# EAGLE design PDB (EAGLE 9.1.3)
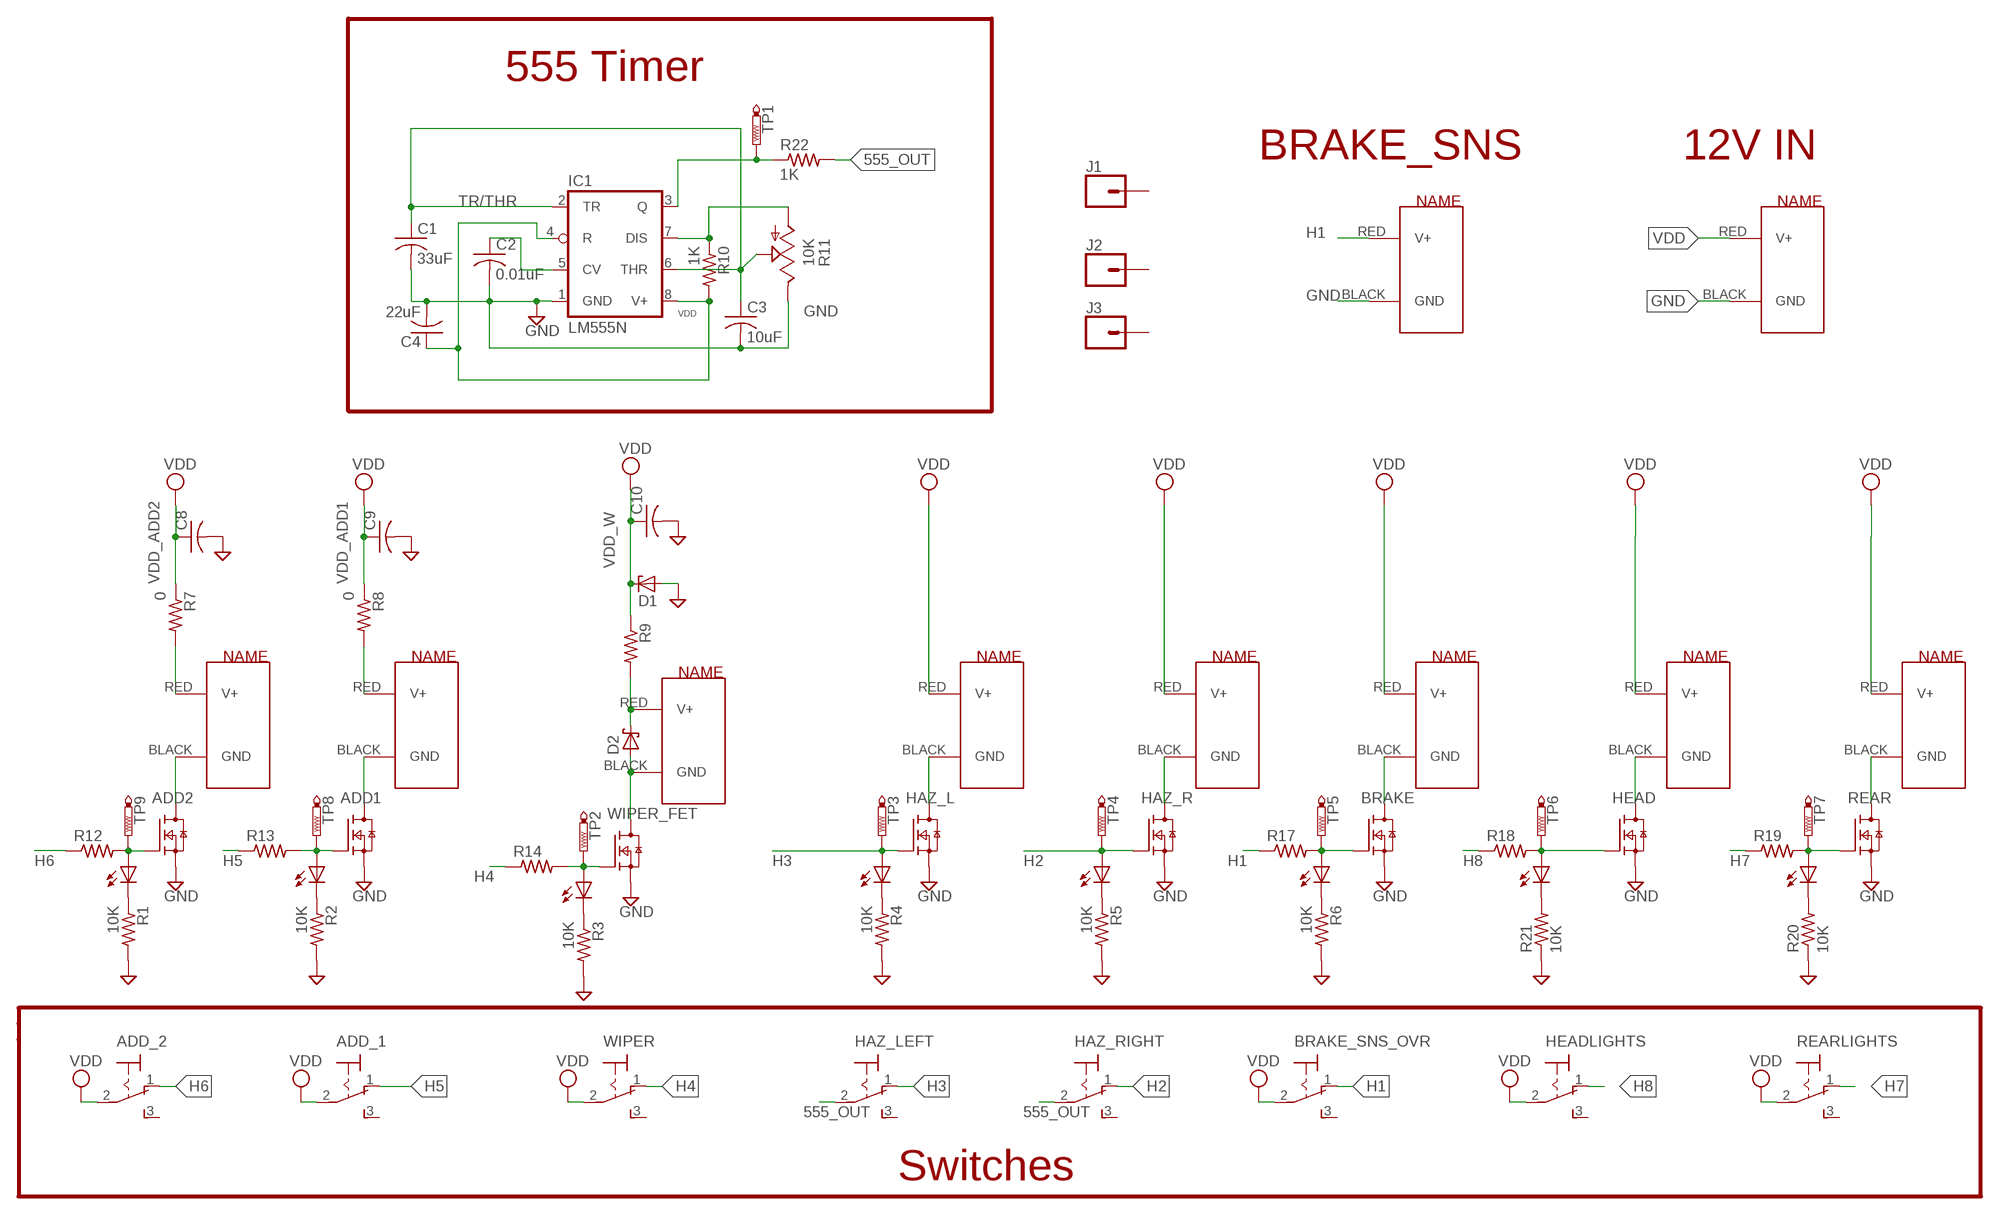
[diagram p0: schematic, sheet 1]

## Parts
ADD1  PSMN039-100YS  [SOT669]
ADD1_OUT  POWERPOLE_POWER25A_HORIZONTAL_G2  [POWERPOLE_PAIR_25A_HORIZ_G2]
ADD2  PSMN039-100YS  [SOT669]
ADD2_OUT  POWERPOLE_POWER25A_HORIZONTAL_G2  [POWERPOLE_PAIR_25A_HORIZ_G2]
ADD_1  M9040P  [M9040P]
ADD_2  M9040P  [M9040P]
BRAKE  PSMN039-100YS  [SOT669]
BRAKE_OUT  POWERPOLE_POWER25A_HORIZONTAL_G2  [POWERPOLE_PAIR_25A_HORIZ_G2]
BRAKE_SNS_OVR  M9040P  [M9040P]
C1  33uF  C-USC0805  [C0805]
C2  0.01uF  C-USC0805  [C0805]
C3  10uF  C-USC0805K  [C0805K]
C4  22uF  C-USC0805  [C0805]
C8  C-USC0805  [C0805]
C9  C-USC0805  [C0805]
C10  C-USC0805  [C0805]
D1  ZENER-DIODEDO34-7  [DO34Z7]
D2  1N5817-B  [DO41-7.6]
HAZ_L  PSMN039-100YS  [SOT669]
HAZ_LEFT  M9040P  [M9040P]
HAZ_R  PSMN039-100YS  [SOT669]
HAZ_RIGHT  M9040P  [M9040P]
HAZL_OUT  POWERPOLE_POWER25A_HORIZONTAL_G2  [POWERPOLE_PAIR_25A_HORIZ_G2]
HAZR_OUT  POWERPOLE_POWER25A_HORIZONTAL_G2  [POWERPOLE_PAIR_25A_HORIZ_G2]
HEAD  PSMN039-100YS  [SOT669]
HEADLIGHTS  M9040P  [M9040P]
HEADLIGHTS_OUT  POWERPOLE_POWER25A_HORIZONTAL_G2  [POWERPOLE_PAIR_25A_HORIZ_G2]
IC1  LM555N  [DIL08]
J1  CONN_01  [1X01]
J2  CONN_01  [1X01]
J3  CONN_01  [1X01]
LED1  LEDCHIP-LED0805  [CHIP-LED0805]
LED2  LEDCHIP-LED0805  [CHIP-LED0805]
LED3  LEDCHIP-LED0805  [CHIP-LED0805]
LED4  LEDCHIP-LED0805  [CHIP-LED0805]
LED5  LEDCHIP-LED0805  [CHIP-LED0805]
LED6  LEDCHIP-LED0805  [CHIP-LED0805]
LED7  LEDCHIP-LED0805  [CHIP-LED0805]
LED8  LEDCHIP-LED0805  [CHIP-LED0805]
R1  10K  R-US_R0805  [R0805]
R2  10K  R-US_R0805  [R0805]
R3  10K  R-US_R0805  [R0805]
R4  10K  R-US_R0805  [R0805]
R5  10K  R-US_R0805  [R0805]
R6  10K  R-US_R0805  [R0805]
R7  0  R-US_R0805  [R0805]
R8  0  R-US_R0805  [R0805]
R9  R-US_R0805  [R0805]
R10  1K  R-US_R0805  [R0805]
R11  10K  TRIM_US-B25U  [B25U]
R12  R-US_R0805  [R0805]
R13  R-US_R0805  [R0805]
R14  R-US_R0805  [R0805]
R17  R-US_R0805  [R0805]
R18  R-US_R0805  [R0805]
R19  R-US_R0805  [R0805]
R20  10K  R-US_R0805  [R0805]
R21  10K  R-US_R0805  [R0805]
R22  1K  R-US_R0805  [R0805]
REAR  PSMN039-100YS  [SOT669]
REARLIGHTS  M9040P  [M9040P]
REARLIGHTS_OUT  POWERPOLE_POWER25A_HORIZONTAL_G2  [POWERPOLE_PAIR_25A_HORIZ_G2]
TP1  PTR1B1,27  [B1,27]
TP2  PTR1B1,27  [B1,27]
TP3  PTR1B1,27  [B1,27]
TP4  PTR1B1,27  [B1,27]
TP5  PTR1B1,27  [B1,27]
TP6  PTR1B1,27  [B1,27]
TP7  PTR1B1,27  [B1,27]
TP8  PTR1B1,27  [B1,27]
TP9  PTR1B1,27  [B1,27]
VDD_IN  POWERPOLE_POWER25A_HORIZONTAL_G2  [POWERPOLE_PAIR_25A_HORIZ_G2]
VDD_IN1  POWERPOLE_POWER25A_HORIZONTAL_G2  [POWERPOLE_PAIR_25A_HORIZ_G2]
WIPER  M9040P  [M9040P]
WIPER_FET  PSMN039-100YS  [SOT669]
WIPER_OUT  POWERPOLE_POWER25A_HORIZONTAL_G2  [POWERPOLE_PAIR_25A_HORIZ_G2]

## Nets
555_OUT: HAZ_LEFT.2(P) HAZ_RIGHT.2(P) R22.2
CV: C2.1 IC1.5(CV)
DIS: IC1.7(DIS) R10.1 R11.A
GND: ADD1.1(S) ADD1.2(S) ADD1.3(S) ADD2.1(S) ADD2.2(S) ADD2.3(S) BRAKE.1(S) BRAKE.2(S) BRAKE.3(S) C1.2 C2.2 C3.2 C4.2 C8.2 C9.2 C10.2 D1.A HAZ_L.1(S) HAZ_L.2(S) HAZ_L.3(S) HAZ_R.1(S) HAZ_R.2(S) HAZ_R.3(S) HEAD.1(S) HEAD.2(S) HEAD.3(S) IC1.1(GND) R1.2 R2.2 R3.2 R4.2 R5.2 R6.2 R11.E R20.1 R21.1 REAR.1(S) REAR.2(S) REAR.3(S) VDD_IN1.BLACK(GND) VDD_IN.BLACK(GND) WIPER_FET.1(S) WIPER_FET.2(S) WIPER_FET.3(S)
H1: BRAKE_SNS_OVR.1(O) R17.1 VDD_IN1.RED(V+)
H2: HAZ_R.4(G) HAZ_RIGHT.1(O) LED5.A TP4.TP
H3: HAZ_L.4(G) HAZ_LEFT.1(O) LED4.A TP3.TP
H4: R14.1 WIPER.1(O)
H5: ADD_1.1(O) R13.1
H6: ADD_2.1(O) R12.1
H7: R19.1 REARLIGHTS.1(O)
H8: HEADLIGHTS.1(O) R18.1
N$1: HEAD.MB(D) HEADLIGHTS_OUT.BLACK(GND)
N$3: REAR.MB(D) REARLIGHTS_OUT.BLACK(GND)
N$7: ADD2.4(G) LED1.A R12.2 TP9.TP
N$8: ADD2.MB(D) ADD2_OUT.BLACK(GND)
N$9: LED8.C R20.2
N$10: LED7.C R21.2
N$11: LED5.C R5.1
N$13: BRAKE.4(G) LED6.A R17.2 TP5.TP
N$14: HEAD.4(G) LED7.A R18.2 TP6.TP
N$15: LED8.A R19.2 REAR.4(G) TP7.TP
N$16: ADD2_OUT.RED(V+) R7.2
N$17: ADD1.MB(D) ADD1_OUT.BLACK(GND)
N$18: ADD1_OUT.RED(V+) R8.2
N$19: D2.A WIPER_FET.MB(D) WIPER_OUT.BLACK(GND)
N$20: D2.C R9.2 WIPER_OUT.RED(V+)
N$21: HAZ_L.MB(D) HAZL_OUT.BLACK(GND)
N$22: LED3.A R14.2 TP2.TP WIPER_FET.4(G)
N$23: HAZ_R.MB(D) HAZR_OUT.BLACK(GND)
N$25: BRAKE.MB(D) BRAKE_OUT.BLACK(GND)
N$26: ADD1.4(G) LED2.A R13.2 TP8.TP
N$27: LED1.C R1.1
N$28: LED2.C R2.1
N$29: LED4.C R4.1
N$30: LED3.C R3.1
N$33: LED6.C R6.1
Q: IC1.3(Q) R22.1 TP1.TP
TR/THR: C1.1 C3.1 IC1.2(TR) IC1.6(THR) R11.S
VDD: ADD_1.2(P) ADD_2.2(P) BRAKE_OUT.RED(V+) BRAKE_SNS_OVR.2(P) C4.1 HAZL_OUT.RED(V+) HAZR_OUT.RED(V+) HEADLIGHTS.2(P) HEADLIGHTS_OUT.RED(V+) IC1.4(R) IC1.8(V+) R10.2 REARLIGHTS.2(P) REARLIGHTS_OUT.RED(V+) VDD_IN.RED(V+) WIPER.2(P)
VDD_ADD1: C9.1 R8.1 ; supply symbol labelled VDD
VDD_ADD2: C8.1 R7.1 ; supply symbol labelled VDD
VDD_W: C10.1 D1.C R9.1 ; supply symbol labelled VDD
Unconnected: ADD_1.3(S) ADD_2.3(S) BRAKE_SNS_OVR.3(S) HAZ_LEFT.3(S) HAZ_RIGHT.3(S) HEADLIGHTS.3(S) J1.1 J2.1 J3.1 REARLIGHTS.3(S) WIPER.3(S)

## Notes on the sheet
- 555 Timer
- BRAKE_SNS | 12V IN
- Switches

## Library data of the parts
ADD1 ADD2 BRAKE HAZ_L HAZ_R HEAD REAR WIPER_FET = nxp_60:PSMN: N-channel logic level TrenchMOS(TM) transistor AAL Eindhoven MK
ADD1_OUT ADD2_OUT BRAKE_OUT HAZL_OUT HAZR_OUT HEADLIGHTS_OUT REARLIGHTS_OUT VDD_IN VDD_IN1 WIPER_OUT = powerpoles:POWERPOLE_POWER: Anderson Powerpole Power Connector using ameteur radio standard layout
ADD_1 ADD_2 BRAKE_SNS_OVR HAZ_LEFT HAZ_RIGHT HEADLIGHTS REARLIGHTS WIPER = switch:M9040P: TOGGLE SWITCH Marquardt
C1-C4 C8-C10 = rcl:C-US: CAPACITOR, American symbol; SPICEPREFIX: C
D1 = diode:ZENER-DIODE: Z-Diode
D2 = diode:1N581*: 1.0A SCHOTTKY BARRIER RECTIFIER Source: http://www.diodes.com/datasheets/ds23001.pdf
IC1 = linear:*555: TIMER
J1-J3 = SparkFun-Connectors:CONN_01: Single connection point. Often used as Generic Header-pin footprint for 0.1 inch spaced/style header connections On any of the 0.1 inch spaced packages, you can populate with these: Break Away Headers - Straight <https://www.sparkfun.com/products/116> (PRT-00116) Break Away Male Headers - Right Angle <https://www.sparkfun.com/products/553> (PRT-00553) Female Headers <https://www.sparkfun.com/products/115> (PRT-00115) Break Away Headers - Machine Pin <https://www.sparkfun.com/products/117> (PRT-00117) Break Away Female Headers - Swiss Machine Pin <https://www.sparkfun.com/products/743> (PRT-00743) This device is also useful as a general connection point to wire up your design to another part of your project. Our various solder wires solder well into these plated through hole pads. Hook-Up Wire - Assortment (Stranded, 22 AWG) <https://www.sparkfun.com/products/11375> (PRT-11375) Hook-Up Wire - Assortment (Solid Core, 22 AWG) <https://www.sparkfun.com/products/11367> (PRT-11367) View the entire wire category on our website here <https://www.sparkfun.com/categories/141> Special notes: SMTSO-256-ET is a "flush mount" nut for a 4-40 screw. We mostly use this on specialty testbeds; it is a nice way to connect hardware to your PCB at an adjustable hieght. Also note, the SNAP packages are for using a snappable style connector. We sell a baggie of snaps and they are also used on two LilyPad designs: Snap Assortment - 30 pack (male and female) <https://www.sparkfun.com/products/11347> (DEV-11347) LilyPad Arduino SimpleSnap <https://www.sparkfun.com/products/10941> (DEV-10941) LilyPad SimpleSnap Protoboard <https://www.sparkfun.com/products/10940> (DEV-10940)
LED1-LED8 = led:LED: LED OSRAM: - CHIPLED LG R971, LG N971, LY N971, LG Q971, LY Q971, LO R971, LY R971 LH N974, LH R974 LS Q976, LO Q976, LY Q976 LO Q996 - Hyper CHIPLED LW Q18S LB Q993, LB Q99A, LB R99A - SideLED LS A670, LO A670, LY A670, LG A670, LP A670 LB A673, LV A673, LT A673, LW A673 LH A674 LY A675 LS A676, LA A676, LO A676, LY A676, LW A676 LS A679, LY A679, LG A679 - Hyper Micro SIDELED® LS Y876, LA Y876, LO Y876, LY Y876 LT Y87S - SmartLED LW L88C, LW L88S LB L89C, LB L89S, LG L890 LS L89K, LO L89K, LY L89K LS L896, LA L896, LO L896, LY L896 - TOPLED LS T670, LO T670, LY T670, LG T670, LP T670 LSG T670, LSP T670, LSY T670, LOP T670, LYG T670 LG T671, LOG T671, LSG T671 LB T673, LV T673, LT T673, LW T673 LH T674 LS T676, LA T676, LO T676, LY T676, LB T676, LH T676, LSB T676, LW T676 LB T67C, LV T67C, LT T67C, LS T67K, LO T67K, LY T67K, LW E67C LS E67B, LA E67B, LO E67B, LY E67B, LB E67C, LV E67C, LT E67C LW T67C LS T679, LY T679, LG T679 LS T770, LO T770, LY T770, LG T770, LP T770 LB T773, LV T773, LT T773, LW T773 LH T774 LS E675, LA E675, LY E675, LS T675 LS T776, LA T776, LO T776, LY T776, LB T776 LHGB T686 LT T68C, LB T68C - Hyper Mini TOPLED® LB M676 - Mini TOPLED Santana® LG M470 LS M47K, LO M47K, LY M47K Source: http://www.osram.convergy.de LUXEON: - LUMILED® LXK2-PW12-R00, LXK2-PW12-S00, LXK2-PW14-U00, LXK2-PW14-V00 LXK2-PM12-R00, LXK2-PM12-S00, LXK2-PM14-U00 LXK2-PE12-Q00, LXK2-PE12-R00, LXK2-PE12-S00, LXK2-PE14-T00, LXK2-PE14-U00 LXK2-PB12-K00, LXK2-PB12-L00, LXK2-PB12-M00, LXK2-PB14-N00, LXK2-PB14-P00, LXK2-PB14-Q00 LXK2-PR12-L00, LXK2-PR12-M00, LXK2-PR14-Q00, LXK2-PR14-R00 LXK2-PD12-Q00, LXK2-PD12-R00, LXK2-PD12-S00 LXK2-PH12-R00, LXK2-PH12-S00 LXK2-PL12-P00, LXK2-PL12-Q00, LXK2-PL12-R00 Source: www.luxeon.com KINGBRIGHT: KA-3528ASYC Source: www.kingbright.com
R1-R10 R12-R14 R17-R22 = rcl:R-US_: RESISTOR, American symbol; SPICEPREFIX: R
R11 = pot:TRIM_US-: POTENTIOMETER
TP1-TP9 = testpad:PTR1: TEST PIN

## Board
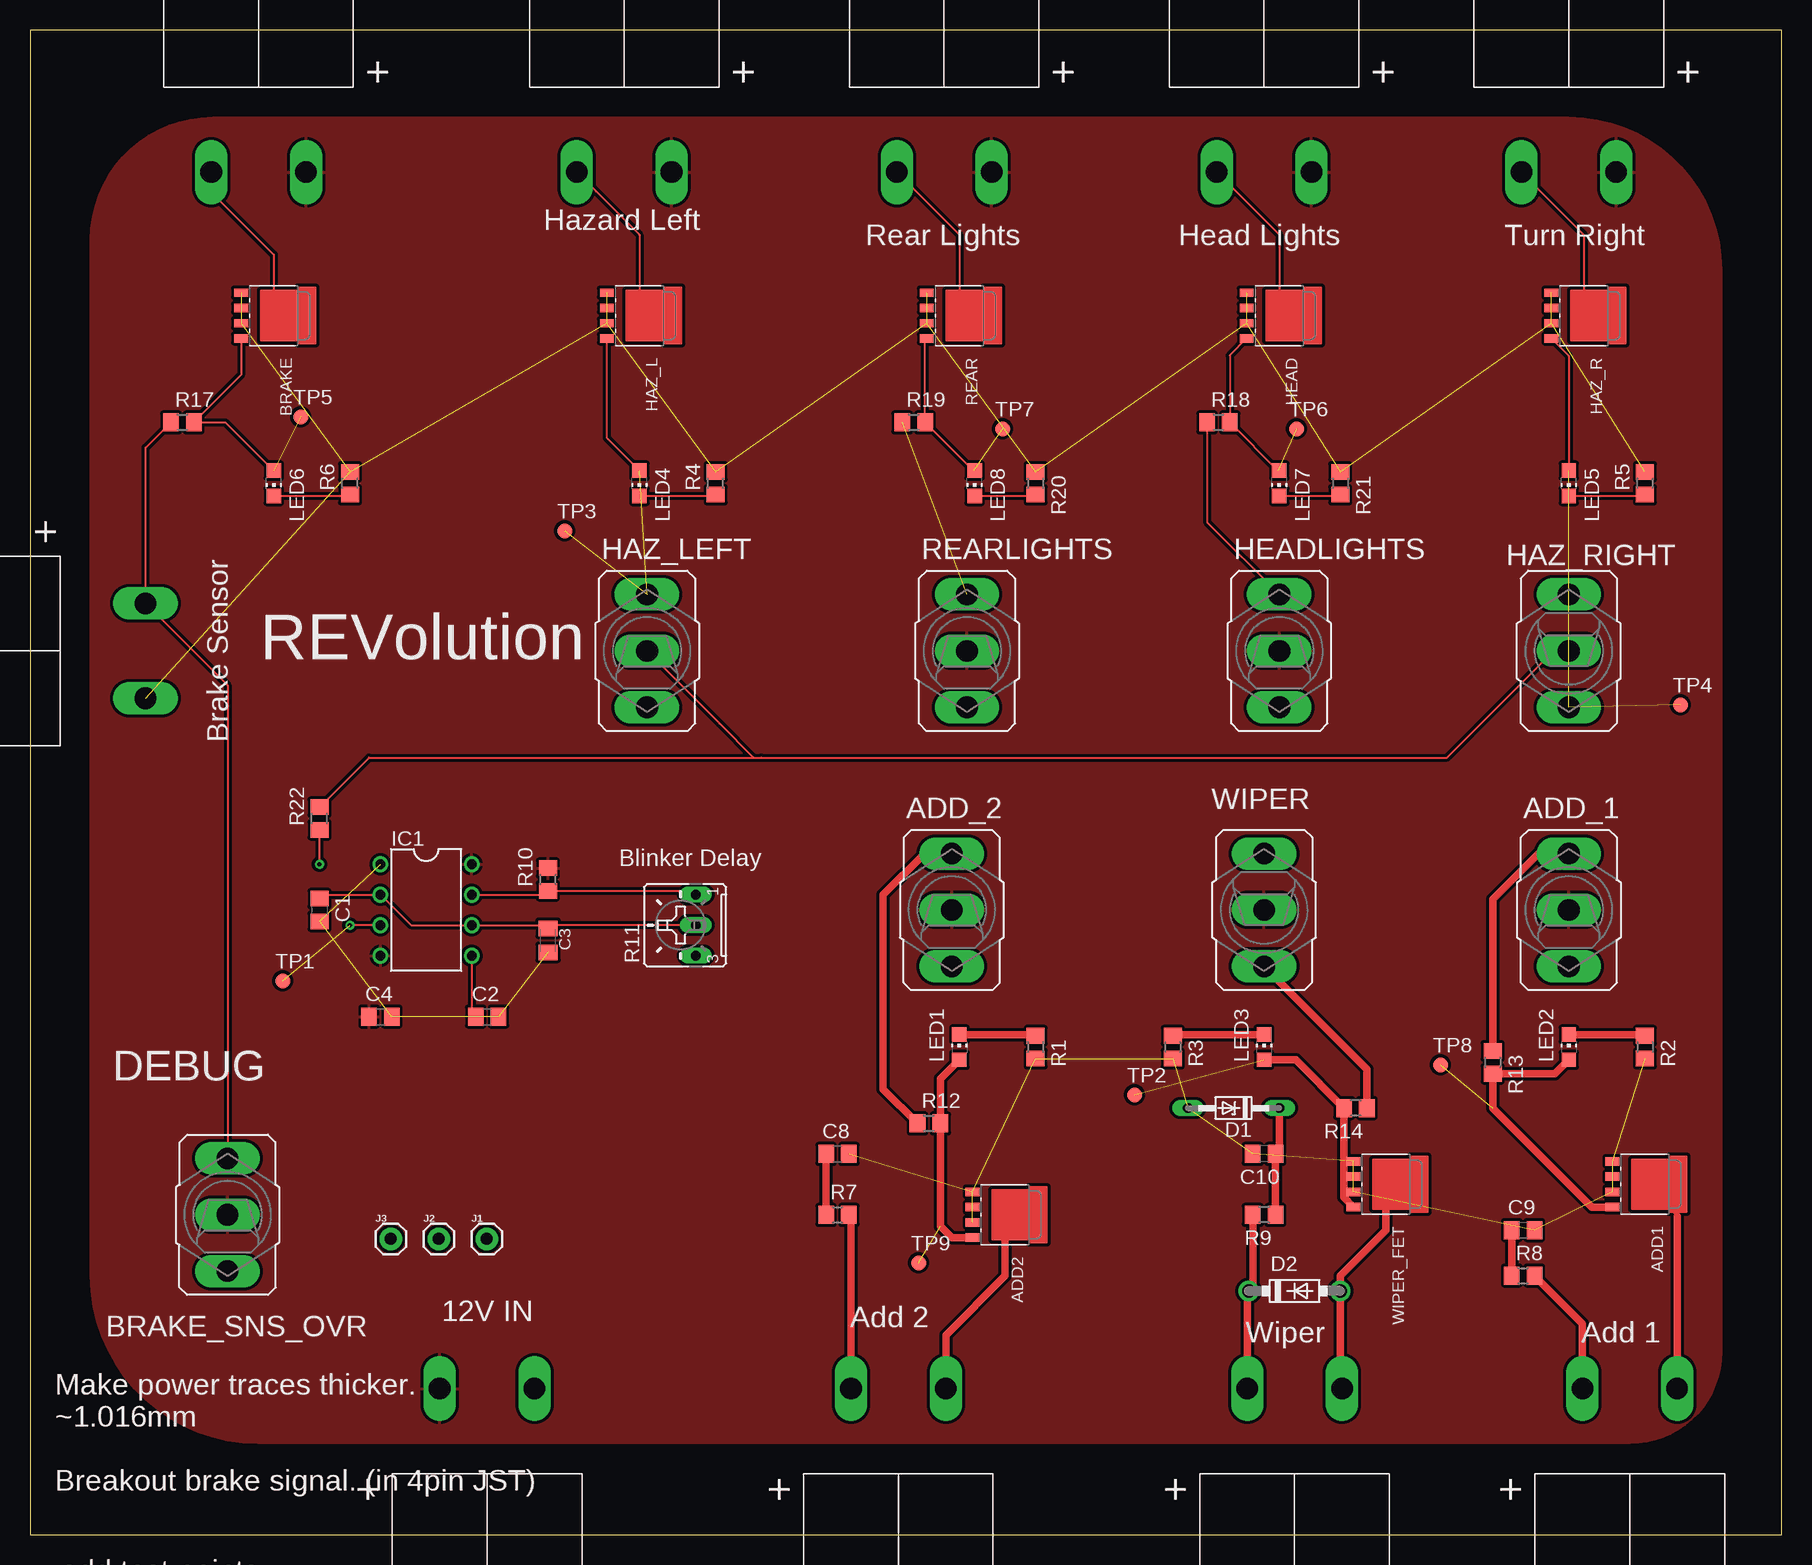
[diagram p1: board, top side]
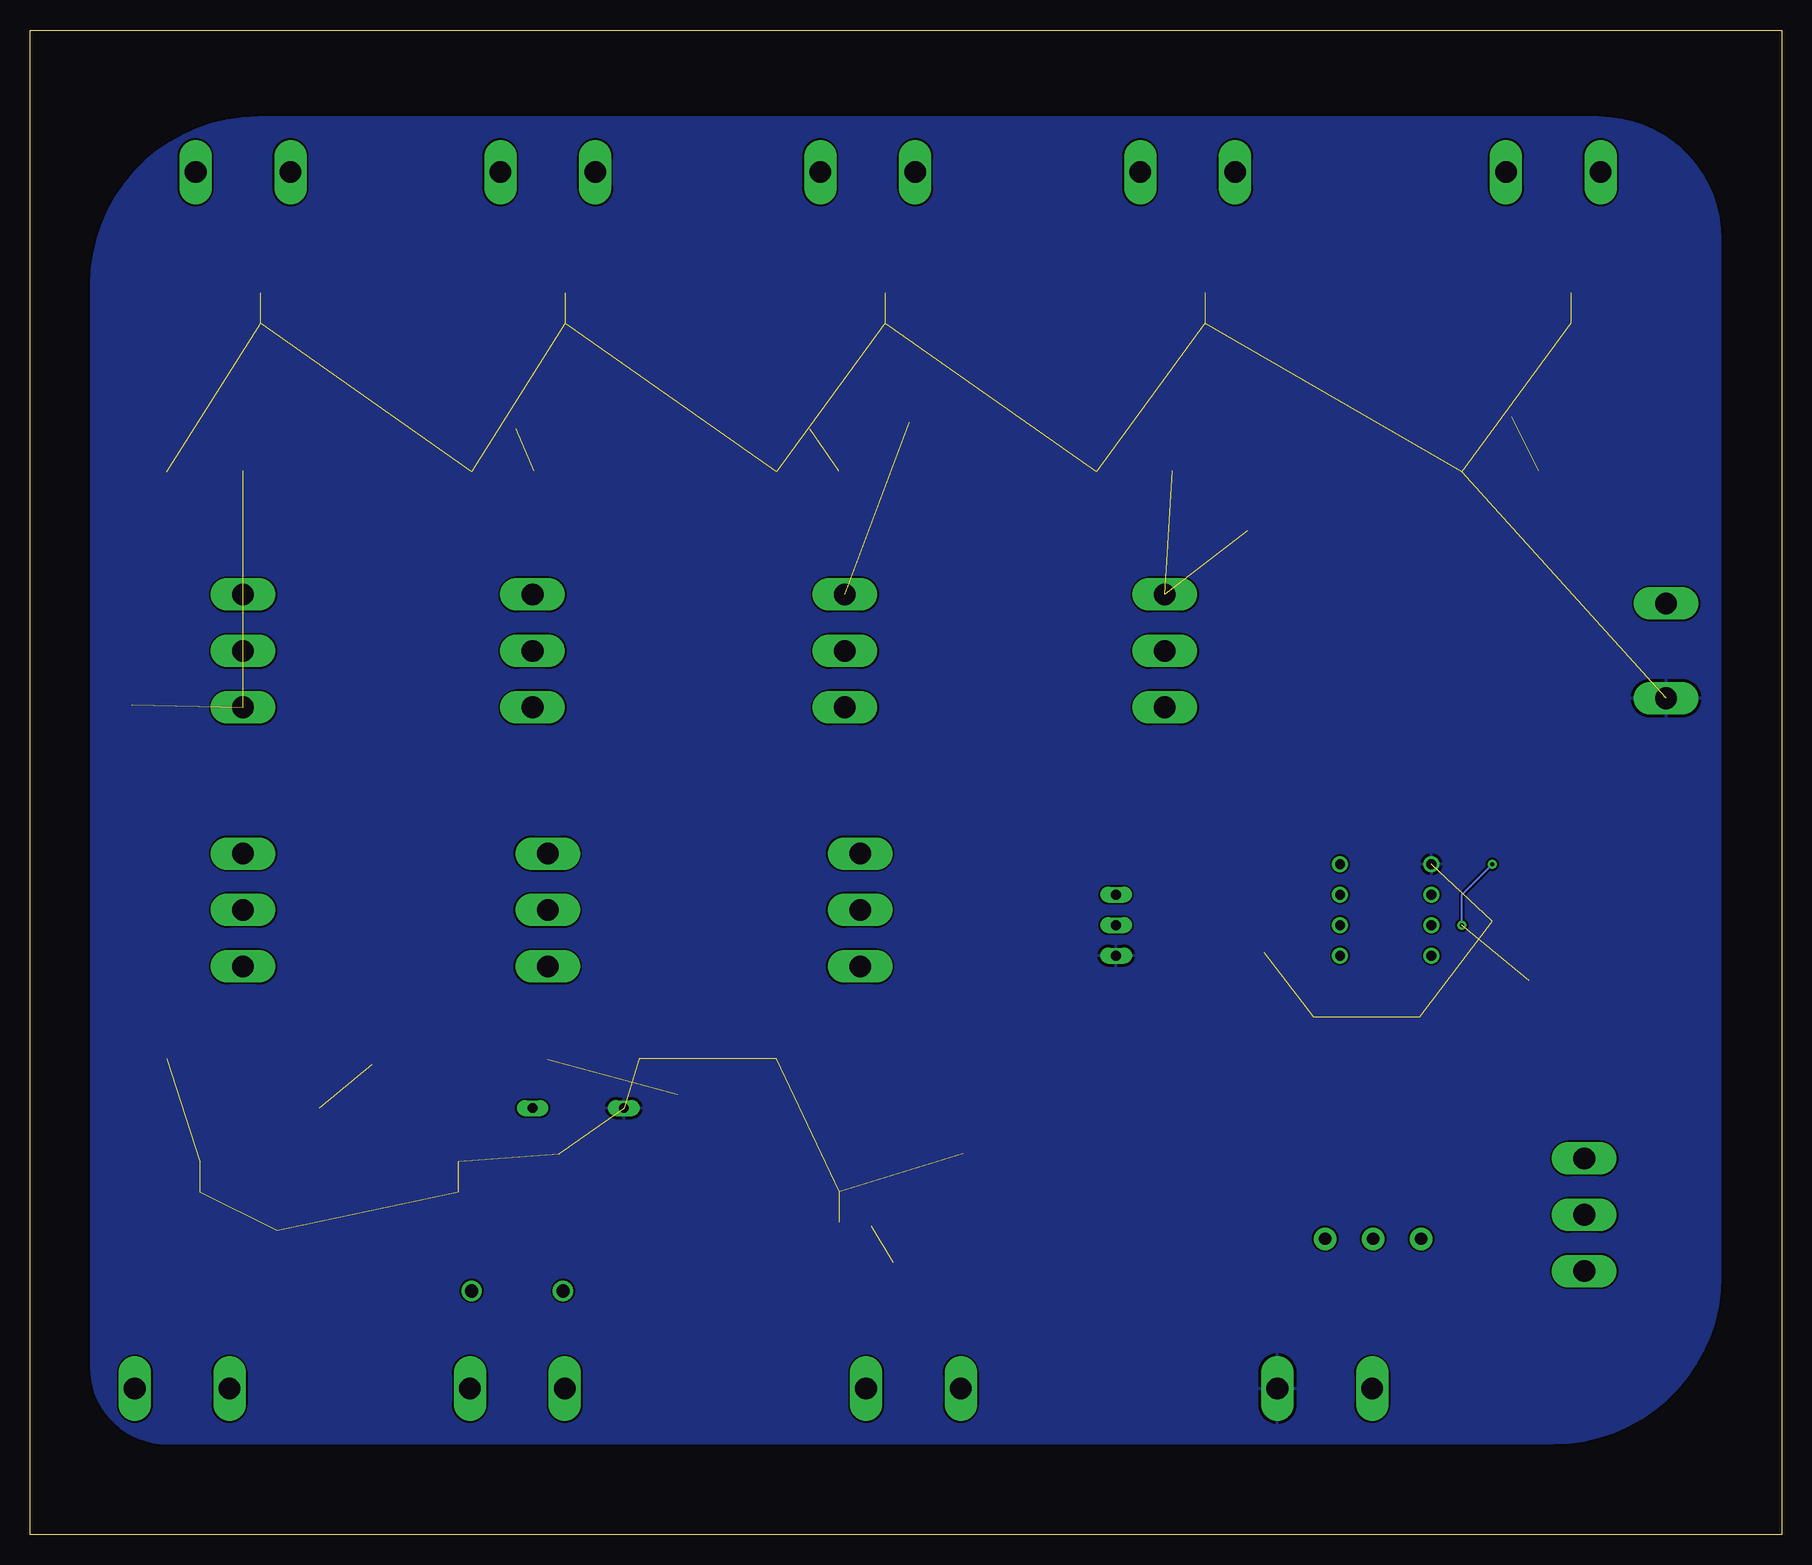
[diagram p2: board, bottom side, seen from below]

Size 146.03 x 125.4 mm. Coordinates in mm from the lower left corner, seen from the top.
Outline: 0,0 146.03,0 146.03,125.4 0,125.4 0,0
Copper layers (1*16): Top 0.035mm / dielectric 1.5mm / Bottom 0.035mm
Design rules "default": minimum track width 6mil, minimum drill 0.35mm, track to track 6mil, track to pad 6mil, pad to pad 6mil, via to via 6mil, smd to smd 6mil, copper to edge 40mil, drill to drill 6mil, minimum pad ring 10mil, minimum via ring 8mil, stop-mask expansion 4mil, vias tented up to drill 0mil, thermal gap 10mil

### Footprints (pad centres in the part's own frame; a part is rotated, then mirrored left to right if it is on the bottom)
SOT669 = smd 0.7 x 1.15: 1 -1.905,-2.725; 2 -0.636,-2.725; 3 0.635,-2.725; 4 1.905,-2.725 | smd 0 x 0: MB 0,0
POWERPOLE_PAIR_25A_HORIZ_G2 = drill 1.8 long: BLACK -3.95,-7.1; RED 3.95,-7.1
M9040P = drill 1.803 long: 1 0,4.699; 2 0,0; 3 0,-4.699
C0805 = smd 1.3 x 1.5: 1 -0.95,0; 2 0.95,0
C0805K = smd 1.3 x 1.6: 1 -1,0; 2 1,0
DO34Z7 = drill 0.813 long: A 3.81,0; C -3.81,0
DO41-7.6 = drill 1.1 pad 1.7: A 3.81,0; C -3.81,0
DIL08 = drill 0.813 pad 1.27: 1 -3.81,-3.81; 2 -1.27,-3.81; 3 1.27,-3.81; 4 3.81,-3.81; 5 3.81,3.81; 6 1.27,3.81; 7 -1.27,3.81; 8 -3.81,3.81
1X01 = drill 1.016 pad 1.88: 1 0,0
CHIP-LED0805 = smd 1.2 x 1.2: A 0,-1.05; C 0,1.05
R0805 = smd 1.3 x 1.5: 1 -0.95,0; 2 0.95,0
B25U = drill 0.813 long: A 2.54,-0.889; E -2.54,-0.889; S 0,-0.889
B1,27 = smd 1.27 x 1.27: TP 0,0

### Placement (x,y rotation side)
ADD1  134.62,29.21 270 top
ADD1_OUT  133.35,5.08 180 top
ADD2  81.28,26.67 270 top
ADD2_OUT  72.39,5.08 180 top
ADD_1  128.27,52.07 0 top
ADD_2  76.84,52.07 0 top
BRAKE  20.32,101.6 270 top
BRAKE_OUT  19.05,120.65 0 top
BRAKE_SNS_OVR  16.47,26.67 0 top
C1  24.13,52.07 270 top
C2  38.1,43.18 0 top
C3  43.18,49.53 270 top
C4  29.21,43.18 0 top
C8  67.31,31.75 0 top
C9  124.46,25.4 0 top
C10  102.87,31.75 180 top
D1  100.33,35.56 180 top
D2  105.41,20.32 0 top
HAZ_L  50.8,101.6 270 top
HAZ_LEFT  51.44,73.66 0 top
HAZ_R  129.54,101.6 270 top
HAZ_RIGHT  128.27,73.66 180 top
HAZL_OUT  49.53,120.65 0 top
HAZR_OUT  128.27,120.65 0 top
HEAD  104.14,101.6 270 top
HEADLIGHTS  104.14,73.66 0 top
HEADLIGHTS_OUT  102.87,120.65 0 top
IC1  33.02,52.07 270 top
J1  38.07,24.66 0 top
J2  34.07,24.66 0 top
J3  30.07,24.66 0 top
LED1  77.47,40.64 0 top
LED2  128.27,40.64 0 top
LED3  102.87,40.64 0 top
LED4  50.8,87.63 180 top
LED5  128.27,87.63 180 top
LED6  20.32,87.63 180 top
LED7  104.14,87.63 180 top
LED8  78.74,87.63 180 top
R1  83.82,40.64 270 top
R2  134.62,40.64 270 top
R3  95.25,40.64 270 top
R4  57.15,87.63 90 top
R5  134.62,87.63 90 top
R6  26.67,87.63 90 top
R7  67.31,26.67 0 top
R8  124.46,21.59 0 top
R9  102.87,26.67 180 top
R10  43.18,54.61 90 top
R11  54.61,50.8 90 top
R12  74.93,34.29 0 top
R13  121.92,39.37 270 top
R14  110.49,35.56 180 top
R17  12.7,92.71 0 top
R18  99.06,92.71 0 top
R19  73.66,92.71 0 top
R20  83.82,87.63 270 top
R21  109.22,87.63 270 top
R22  24.13,59.69 90 top
REAR  77.47,101.6 270 top
REARLIGHTS  78.1,73.66 0 top
REARLIGHTS_OUT  76.2,120.65 0 top
TP1  21.07,46.16 0 top
TP2  92.07,36.66 0 top
TP3  44.57,83.66 0 top
TP4  137.57,69.16 0 top
TP5  22.57,93.16 0 top
TP6  105.57,92.16 0 top
TP7  81.07,92.16 0 top
TP8  117.57,39.16 0 top
TP9  74.07,22.66 0 top
VDD_IN  38.1,5.08 180 top
VDD_IN1  2.54,73.66 90 top
WIPER  102.87,52.07 180 top
WIPER_FET  113.03,29.21 270 top
WIPER_OUT  105.41,5.08 180 top

### Tracks (layer width: path | path; a pad name or v marks a point on that pad's centre or on a via)
555_OUT
  Top 0.152: HAZ_LEFT.2 57.47,67.63 60.32,64.77 60.96,64.77 | 60.96,64.77 118.11,64.77 127,73.66 HAZ_RIGHT.2 | R22.2 28.26,64.77 60.96,64.77
CV
  Top 0.152: IC1.5 36.83,43.5 C2.1
DIS
  Top 0.152: IC1.7 42.86,53.34 R10.1 55.18,53.66 R11.A
GND  (39 unrouted)
  pour Bottom: 5.08,72.39 5.08,107.95 arc-90 15.24,118.11 127,118.11 arc-90 140.97,104.14 140.97,13.97 arc-90 134.62,7.62 19.05,7.62 arc-90 5.08,21.59 5.08,71.12
H1
  Top 0.152: R17.1 9.64,90.6 VDD_IN1.RED 16.47,70.78 BRAKE_SNS_OVR.1
H2  (2 unrouted)
  Top 0.152: HAZ_R.4 128.27,98.24 LED5.A
H3  (2 unrouted)
  Top 0.152: HAZ_L.4 48.08,91.41 LED4.A
H4
  Top 0.61: WIPER.1 111.44,38.8 R14.1
H5
  Top 0.61: R13.1 121.92,52.96 125.73,56.77 ADD_1.1
H6
  Top 0.61: R12.1 71.12,37.15 71.12,53.34 74.55,56.77 ADD_2.1
H7  (1 unrouted)
H8
  Top 0.152: R18.1 98.11,84.39 HEADLIGHTS.1
N$1
  Top 0.152: HEADLIGHTS_OUT.BLACK 104.14,108.33 HEAD.MB
N$3
  Top 0.152: REARLIGHTS_OUT.BLACK 77.47,108.33 REAR.MB
N$7  (1 unrouted)
  Top 0.61: ADD2.4 76.84,24.77 75.88,25.72 R12.2 75.88,38 LED1.A
N$8
  Top 0.61: ADD2_OUT.BLACK 76.34,16.65 81.28,21.59 ADD2.MB
N$9
  Top 0.152: LED8.C 83.72,86.58 R20.2
N$10
  Top 0.152: LED7.C 109.12,86.58 R21.2
N$11
  Top 0.152: LED5.C 134.52,86.58 R5.1
N$13  (1 unrouted)
  Top 0.152: BRAKE.4 17.59,96.66 R17.2 16.29,92.71 LED6.A
N$14  (1 unrouted)
  Top 0.152: HEAD.4 100.01,98.29 R18.2 104.04,88.68 LED7.A
N$15  (1 unrouted)
  Top 0.152: REAR.4 74.61,99.56 R19.2 78.64,88.68 LED8.A
N$16
  Top 0.152: 68.44,26.49 R7.2
  Top 0.61: ADD2_OUT.RED 68.44,26.49
N$17
  Top 0.152: 137.3,26.53 ADD1.MB
  Top 0.61: ADD1_OUT.BLACK 137.3,26.53
N$18
  Top 0.61: ADD1_OUT.RED 129.4,17.6 R8.2
N$19
  Top 0.152: WIPER_OUT.BLACK 109.22,12.32
  Top 0.61: WIPER_FET.MB 113.03,25.4 109.22,21.59 D2.A 109.22,12.32
N$20
  Top 0.152: D2.C 101.46,20.18
  Top 0.61: 101.46,20.18 WIPER_OUT.RED | D2.C 101.92,20.64 R9.2
N$21
  Top 0.152: HAZL_OUT.BLACK 47.18,111.95 50.8,108.33 HAZ_L.MB
N$22  (1 unrouted)
  Top 0.152: 109.54,31.6 109.5,31.56
  Top 0.61: 109.54,31.6 R14.2 105.51,39.59 LED3.A | 109.5,31.56 109.5,28.11 WIPER_FET.4
N$23
  Top 0.152: HAZR_OUT.BLACK 129.54,108.33 HAZ_R.MB
N$25
  Top 0.152: BRAKE_OUT.BLACK 15.1,111.9 20.32,106.68 BRAKE.MB
N$26  (1 unrouted)
  Top 0.61: ADD1.4 130.17,27.3 121.92,35.56 R13.2 127.1,38.42 LED2.A
N$27
  Top 0.152: 83.72,41.69 R1.1
  Top 0.61: LED1.C 83.72,41.69
N$28
  Top 0.152: 134.52,41.69 R2.1
  Top 0.61: LED2.C 134.52,41.69
N$29
  Top 0.152: LED4.C 57.05,86.58 R4.1
N$30
  Top 0.152: 95.35,41.69 R3.1
  Top 0.61: LED3.C 95.35,41.69
N$33
  Top 0.152: LED6.C 26.57,86.58 R6.1
Q  (via drill 0.35)  (1 unrouted)
  Top 0.152: IC1.3 v26.67,50.8 | v24.13,55.88 R22.1
  Bottom 0.152: v26.67,50.8 26.67,53.34 v24.13,55.88
TR/THR
  Top 0.152: C1.1 24.45,53.34 IC1.2 31.75,50.8 IC1.6 42.91,50.8 C3.1 43.45,50.8 R11.S
VDD
  pour Top (isolate 0.254): 5.08,62.23 5.08,107.95 arc-90 15.24,118.11 27.94,118.11 128.27,118.11 arc-90 140.97,105.41 140.97,15.24 arc-90 133.35,7.62 19.05,7.62 arc-90 5.08,21.59
VDD_ADD1
  Top 0.61: R8.1 C9.1
VDD_ADD2
  Top 0.61: R7.1 C8.1
VDD_W
  Top 0.152: C10.1 104.14,32.07
  Top 0.61: R9.1 C10.1 | 104.14,32.07 D1.C

### Text on the board
tNames: Hazard Left | Rear Lights | Head Lights | Turn Right | REVolution | Brake Sensor | Blinker Delay | DEBUG | Add 2 | 12V IN | Wiper | Add 1 | Make power traces thicker. / ~1.016mm / / Breakout brake signal. (in 4pin JST) | add test points